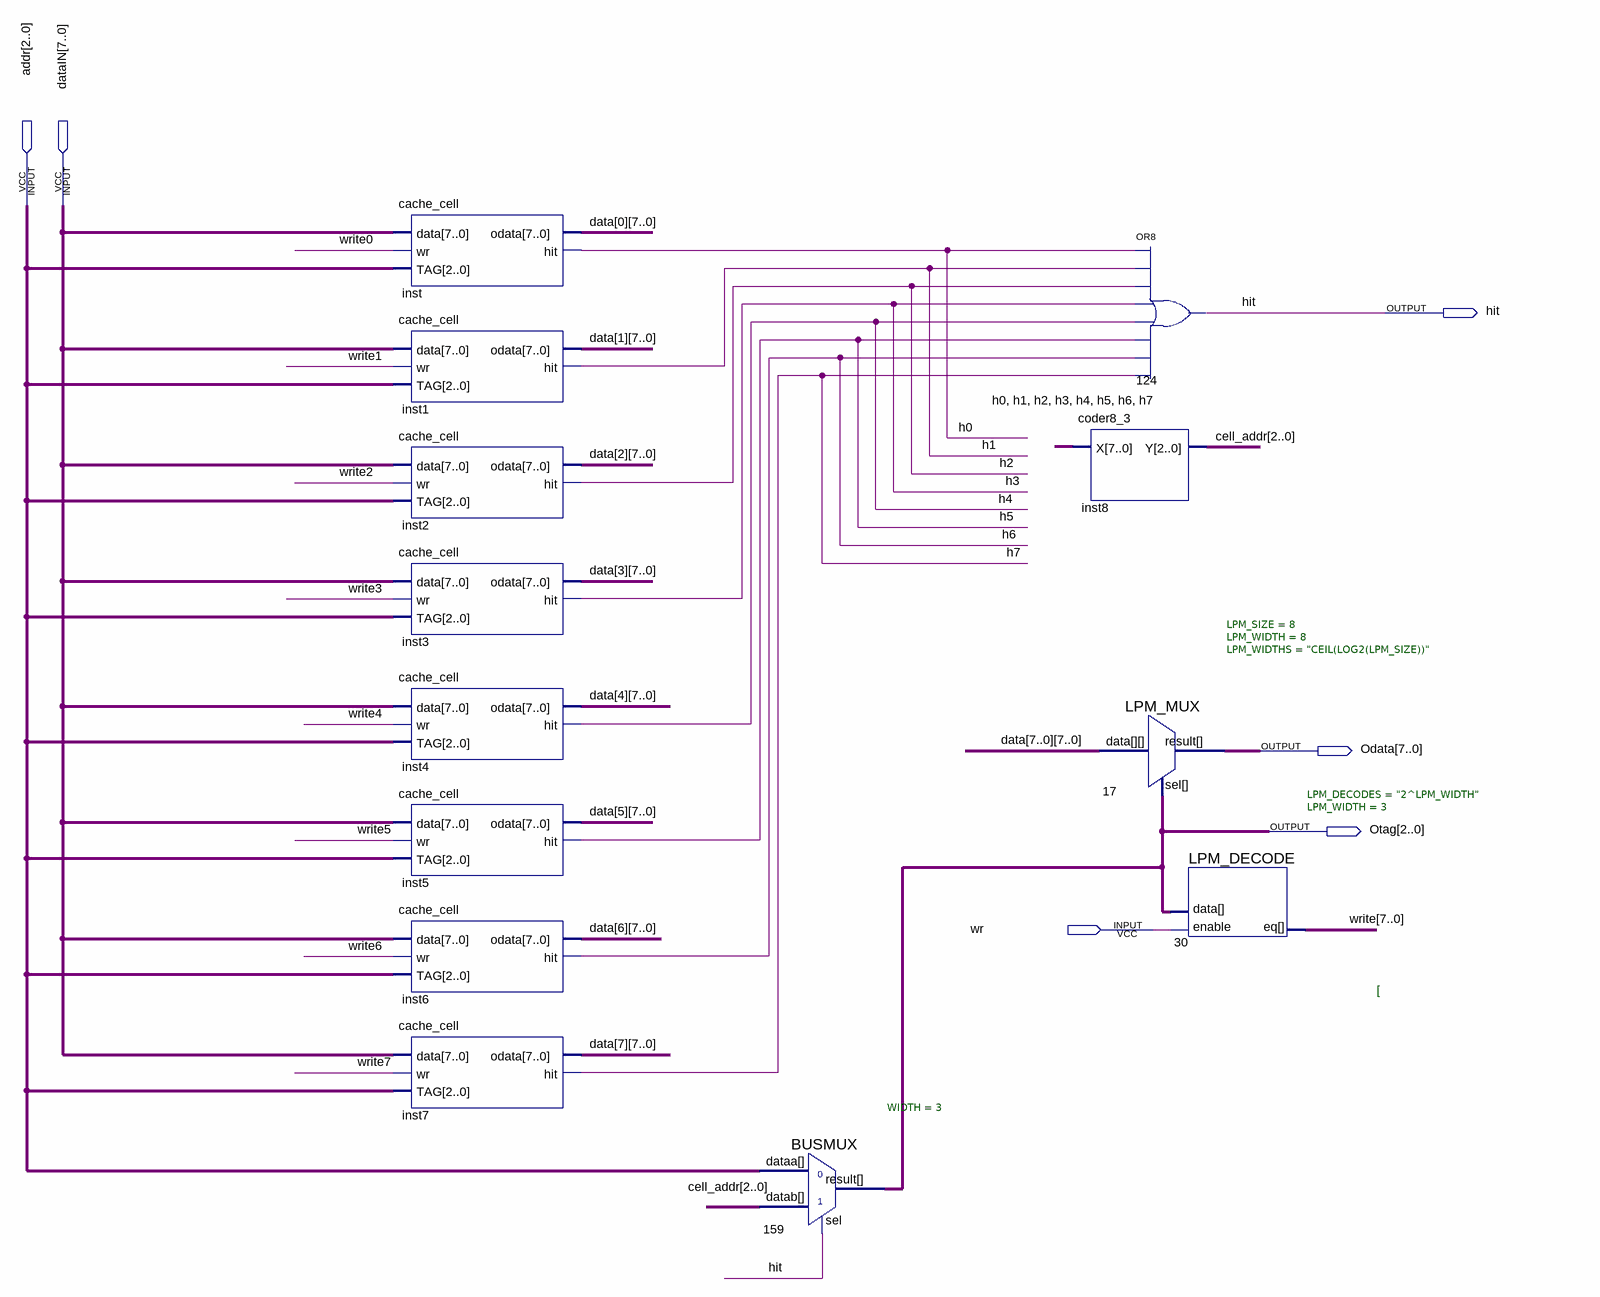
[diagram p0: schematic sheet]
// Quartus schematic cache.bdf as structural Verilog: 13 symbols, 6 pins
module cache (
  input  [2:0] addr,
  input  [7:0] dataIN,
  input  wr,
  output hit,
  output [7:0] Odata,
  output [2:0] Otag
);

  wire h0, h1, h2, h3, h4, h5, h6, h7;
  wire [2:0] cell_addr;
  wire [7:0] data_0, data_1, data_2, data_3, data_4, data_5, data_6, data_7, write;

  cache_cell inst (.data(dataIN), .wr(write[0]), .TAG(addr), .odata(data_0), .hit(h0));
  cache_cell inst1 (.data(dataIN), .wr(write[1]), .TAG(addr), .odata(data_1), .hit(h1));
  cache_cell inst2 (.data(dataIN), .wr(write[2]), .TAG(addr), .odata(data_2), .hit(h2));
  cache_cell inst3 (.data(dataIN), .wr(write[3]), .TAG(addr), .odata(data_3), .hit(h3));
  cache_cell inst4 (.data(dataIN), .wr(write[4]), .TAG(addr), .odata(data_4), .hit(h4));
  cache_cell inst5 (.data(dataIN), .wr(write[5]), .TAG(addr), .odata(data_5), .hit(h5));
  cache_cell inst6 (.data(dataIN), .wr(write[6]), .TAG(addr), .odata(data_6), .hit(h6));
  cache_cell inst7 (.data(dataIN), .wr(write[7]), .TAG(addr), .odata(data_7), .hit(h7));
  BUSMUX #(.WIDTH(3)) u_159 (.datab(cell_addr), .sel(hit), .dataa(addr), .result(Otag));
  or u_124 (hit, h0, h1, h2, h3, h4, h5, h6, h7);
  coder8_3 inst8 (.X({h0, h1, h2, h3, h4, h5, h6, h7}), .Y(cell_addr));
  LPM_MUX #(.LPM_SIZE(8), .LPM_WIDTH(8), .LPM_WIDTHS("CEIL(LOG2(LPM_SIZE))")) u_17 (
    .sel(Otag), .data({data_7, data_6, data_5, data_4, data_3, data_2, data_1, data_0}), .result(Odata));
  LPM_DECODE #(.LPM_DECODES("2^LPM_WIDTH"), .LPM_WIDTH(3)) u_30 (.enable(wr), .data(Otag), .eq(write));

  // Notes on the sheet:
  //   [
endmodule
